# Altium project PDP-11-CPU.PrjPcb
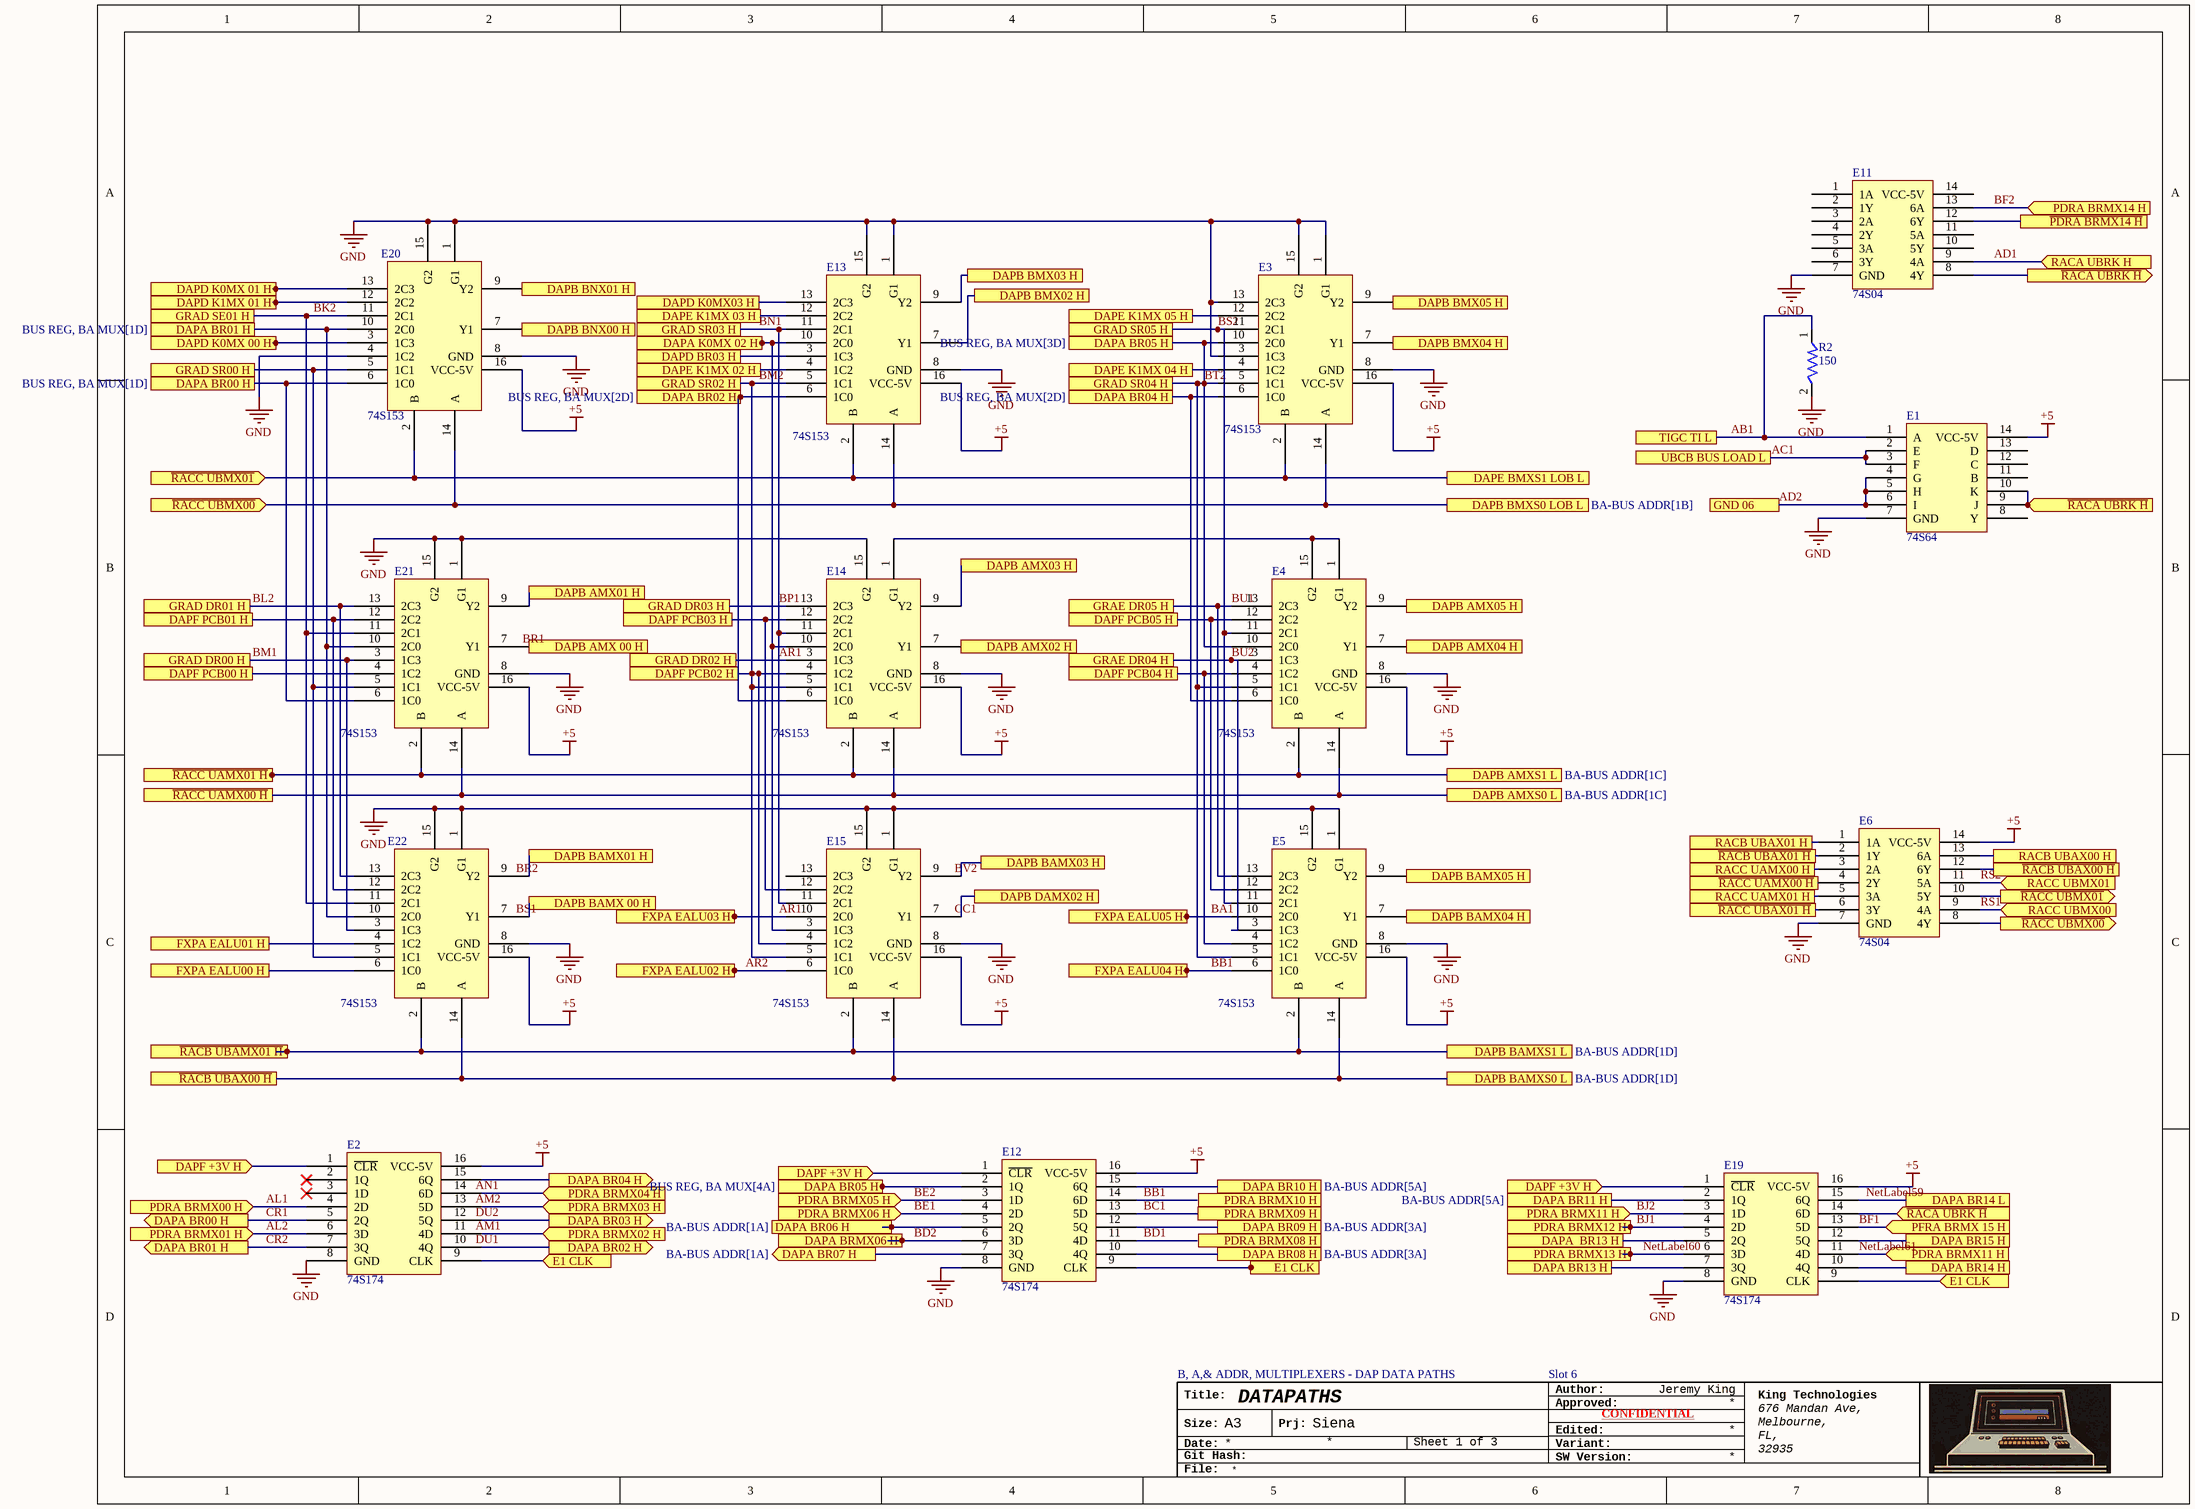
[diagram p0: BUS REG, BA MUX.SchDoc]
3 sheets, 27 parts. Net scope: flat (ports and power ports of the same name join across sheets).
Board file: PDP-11-CPU.PcbDoc
Sheets:
  BUS REG, BA MUX.SchDoc
  BA-BUS ADDR.SchDoc
  BA, BUS MUX.SchDoc

## Sheet BUS REG, BA MUX.SchDoc: DATAPATHS
size A3; Date: .Date; Author: Jeremy King; CompanyName: King Technologies; DrawnBy: Jeremy King; Engineer: Jeremy King; Organization: King Technologies; Address1: 676 Mandan Ave,; Address2: Melbourne,; Address3: FL,; Address4: 32935; DocumentNumber: 1; Revision: 1; SheetNumber: 1; SheetTotal: 3; ProjectTitle: Siena; Time: .Time

### Parts
E1  74S64  [DIP14]
E2  74S174  [DIP16-300]
E3  74S153  [DIP16]
E4  74S153  [DIP16]
E5  74S153  [DIP16]
E6  74S04  [DIP14]
E11  74S04  [DIP14]
E12  74S174  [DIP16-300]
E13  74S153  [DIP16]
E14  74S153  [DIP16]
E15  74S153  [DIP16]
E19  74S174  [DIP16-300]
E20  74S153  [DIP16]
E21  74S153  [DIP16]
E22  74S153  [DIP16]
R2  150  [Axial 0.6]

### Ports
DAPA  BR13 H, DAPA BR00 H (out, see BUS REG, BA MUX[1B]), DAPA BR00 H (see BUS REG, BA MUX[1D]), DAPA BR01 H (out, see BUS REG, BA MUX[1A]), DAPA BR01 H (see BUS REG, BA MUX[1D]), DAPA BR02 H (out, see BUS REG, BA MUX[3B]), DAPA BR02 H (see BUS REG, BA MUX[2D]), DAPA BR03 H (out), DAPA BR04 H (out, see BUS REG, BA MUX[4B]), DAPA BR04 H (see BUS REG, BA MUX[2D]), DAPA BR05 H (see BUS REG, BA MUX[3D]), DAPA BR05 H (see BUS REG, BA MUX[4A]), DAPA BR06 H (out, see BA-BUS ADDR[1A]), DAPA BR07 H (out, see BA-BUS ADDR[1A]), DAPA BR08 H (see BA-BUS ADDR[3A]), DAPA BR09 H (see BA-BUS ADDR[3A]), DAPA BR10 H (see BA-BUS ADDR[5A]), DAPA BR11 H (see BA-BUS ADDR[5A]), DAPA BR13 H, DAPA BR14 H, DAPA BR14 L, DAPA BR15 H, DAPA BRMX06 H (in), DAPA K0MX 02 H, DAPB AMX01 H, DAPB AMX02 H, DAPB AMX03 H, DAPB AMX04 H, DAPB AMX05 H, DAPB AMX 00 H, DAPB AMXS0 L (see BA-BUS ADDR[1C]), DAPB AMXS1 L (see BA-BUS ADDR[1C]), DAPB BAMX01 H, DAPB BAMX03 H, DAPB BAMX04 H, DAPB BAMX05 H, DAPB BAMX 00 H, DAPB BAMXS0 L (see BA-BUS ADDR[1D]), DAPB BAMXS1 L (see BA-BUS ADDR[1D]), DAPB BMX02 H, DAPB BMX03 H, DAPB BMX04 H, DAPB BMX05 H, DAPB BMXS0 LOB L (see BA-BUS ADDR[1B]), DAPB BNX00 H, DAPB BNX01 H, DAPB DAMX02 H, DAPD BR03 H, DAPD K0MX03 H, DAPD K0MX 00 H, DAPD K0MX 01 H, DAPD K1MX 01 H, DAPE BMXS1 LOB L, DAPE K1MX 02 H, DAPE K1MX 03 H, DAPE K1MX 04 H, DAPE K1MX 05 H, DAPF +3V H (in, see BUS REG, BA MUX[1D], BUS REG, BA MUX[3D]), DAPF +3V H (in, see BUS REG, BA MUX[1D], BUS REG, BA MUX[6D]), DAPF +3V H (in, see BUS REG, BA MUX[3D], BUS REG, BA MUX[6D]), DAPF PCB00 H, DAPF PCB01 H, DAPF PCB02 H, DAPF PCB03 H, DAPF PCB04 H, DAPF PCB05 H, E1 CLK (in, see BUS REG, BA MUX[2D], BUS REG, BA MUX[5D]), E1 CLK (in, see BUS REG, BA MUX[2D], BUS REG, BA MUX[8D]), E1 CLK (in, see BUS REG, BA MUX[5D], BUS REG, BA MUX[8D]), FXPA EALU00 H, FXPA EALU01 H, FXPA EALU02 H, FXPA EALU03 H, FXPA EALU04 H, FXPA EALU05 H, GND 06, GRAD DR00 H, GRAD DR01 H, GRAD DR02 H, GRAD DR03 H, GRAD SE01 H, GRAD SR00 H, GRAD SR02 H, GRAD SR03 H, GRAD SR04 H, GRAD SR05 H, GRAE DR04 H, GRAE DR05 H, PDRA BRMX00 H (in), PDRA BRMX01 H (in), PDRA BRMX02 H (in), PDRA BRMX03 H (in), PDRA BRMX04 H (in), PDRA BRMX05 H (in), PDRA BRMX06 H (in), PDRA BRMX08 H (in), PDRA BRMX09 H (in), PDRA BRMX10 H (in), PDRA BRMX11 H (in, see BUS REG, BA MUX[6D]), PDRA BRMX11 H (in, see BUS REG, BA MUX[7D]), PDRA BRMX12 H (in), PDRA BRMX13 H (in), PDRA BRMX14 H (in), PFRA BRMX 15 H (in), RACA UBRK H (in), RACB UBAX00 H, RACB UBAX01 H, RACC UAMX00 H, RACC UAMX01 H, RACC UBMX00 (in), RACC UBMX01 (in), TIGC TI L, UBCB BUS LOAD L, ~{PDRA BRMX14 H}, ~{RACA UBRK H} (in, see BUS REG, BA MUX[7D], BUS REG, BA MUX[8A]), ~{RACA UBRK H} (in, see BUS REG, BA MUX[8A], BUS REG, BA MUX[8B]), ~{RACA UBRK H} (out, see BUS REG, BA MUX[7D], BUS REG, BA MUX[8B]), ~{RACB UBAMX01 H}, ~{RACB UBAX00 H} (see BUS REG, BA MUX[1C]), ~{RACB UBAX00 H} (see BUS REG, BA MUX[8C]), ~{RACB UBAX01 H}, ~{RACC UAMX00 H} (see BUS REG, BA MUX[1C]), ~{RACC UAMX00 H} (see BUS REG, BA MUX[7C]), ~{RACC UAMX01 H}, ~{RACC UBAX01 H}, ~{RACC UBMX00} (in, see BUS REG, BA MUX[8C]), ~{RACC UBMX00} (out, see BUS REG, BA MUX[1B]), ~{RACC UBMX01} (in, see BUS REG, BA MUX[8C]), ~{RACC UBMX01} (out, see BUS REG, BA MUX[1B])

### Nets
+5: E1.14(VCC-5V) E2.16(VCC-5V) E3.16(VCC-5V) E4.16(VCC-5V) E5.16(VCC-5V) E6.14(VCC-5V) E12.16(VCC-5V) E13.16(VCC-5V) E14.16(VCC-5V) E15.16(VCC-5V) E19.16(VCC-5V) E20.16(VCC-5V) E21.16(VCC-5V) E22.16(VCC-5V)
GND: E1.7(GND) E2.8(GND) E3.1(G1) E3.3(1C3) E3.8(GND) E3.13(2C3) E3.15(G2) E4.8(GND) E5.1(G1) E5.8(GND) E5.15(G2) E6.7(GND) E11.7(GND) E12.8(GND) E13.1(G1) E13.8(GND) E13.15(G2) E14.8(GND) E14.15(G2) E15.1(G1) E15.8(GND) E15.15(G2) E19.8(GND) E20.1(G1) E20.4(1C2) E20.8(GND) E20.15(G2) E21.1(G1) E21.8(GND) E21.15(G2) E22.1(G1) E22.8(GND) E22.15(G2) R2.2
AB1: E1.1(A) R2.1 ; port TIGC TI L
AC1: E1.2(E) E1.3(F) ; port UBCB BUS LOAD L
AD1: E11.9(4A) ; port RACA UBRK H
AD2: E1.4(G) E1.5(H) E1.6(I) ; port GND 06
AL1: E2.4(2D) ; port PDRA BRMX00 H
AL2: E2.6(3D) ; port PDRA BRMX01 H
AR1: E13.11(2C1) E14.3(1C3) E14.11(2C1) E14.13(2C3) E15.10(2C0) E15.11(2C1) ; port GRAD SR03 H, port GRAD DR03 H, port GRAD DR02 H, port FXPA EALU03 H  [also labelled BN1, BP1]
AR2: E15.6(1C0) ; port FXPA EALU02 H
BA1: E5.10(2C0) ; port FXPA EALU05 H
BB1: E5.6(1C0) E12.14(6D) ; port FXPA EALU04 H
BC1: E12.13(5D)
BD1: E12.11(4D)
BD2: E12.6(3D) ; port DAPA BRMX06 H
BE1: E12.4(2D) ; port PDRA BRMX06 H
BE2: E12.3(1D) ; port PDRA BRMX05 H
BF1: E19.13(5D) ; port PFRA BRMX 15 H
BF2: E11.13(6A) ; port PDRA BRMX14 H
BJ1: E19.4(2D) ; port PDRA BRMX12 H
BJ2: E19.3(1D) E19.11(4D) ; port PDRA BRMX11 H  [also labelled NetLabel61]
BK2: E20.11(2C1) E21.11(2C1) E22.11(2C1) ; port GRAD SE01 H
BL2: E21.13(2C3) E22.13(2C3) ; port GRAD DR01 H
BM1: E21.3(1C3) E22.3(1C3) ; port GRAD DR00 H
BM2: E13.5(1C1) E14.4(1C2) E14.5(1C1) E15.4(1C2) E15.5(1C1) ; port GRAD SR02 H, port DAPF PCB02 H
BS2: E3.11(2C1) E4.11(2C1) E5.11(2C1) ; port GRAD SR05 H
BT2: E3.5(1C1) E3.10(2C0) E4.5(1C1) E4.10(2C0) E5.5(1C1) E12.2(1Q) ; port DAPA BR05 H, port GRAD SR04 H
BU1: E4.13(2C3) E5.13(2C3) ; port GRAE DR05 H
BU2: E4.3(1C3) E5.3(1C3) ; port GRAE DR04 H
CR1: E2.5(2Q) E20.6(1C0) E21.6(1C0) ; port DAPA BR00 H
CR2: E2.7(3Q) E20.10(2C0) E21.10(2C0) E22.10(2C0) ; port DAPA BR01 H
NetLabel59: E19.15(6Q) ; port DAPA BR14 L
NetLabel60: E19.6(3D) ; port PDRA BRMX13 H
RS1: E6.9(4A) ; port RACC UBMX00
RS2: E6.11(5A) ; port RACC UBMX01
NetE1_9: E1.9(J) E1.10(K) E11.8(4Y) E19.14(6D) ; port ~{RACA UBRK H}
NetE2_1: E2.1(~{CLR}) E12.1(~{CLR}) E19.1(~{CLR}) ; port DAPF +3V H
NetE2_9: E2.9(CLK) E12.9(CLK) E19.9(CLK) ; port E1 CLK
NetE2_10: E2.10(4Q) E13.6(1C0) E14.6(1C0) ; port DAPA BR02 H
NetE2_11: E2.11(4D) ; port PDRA BRMX02 H
NetE2_12: E2.12(5Q) ; port DAPA BR03 H
NetE2_13: E2.13(5D) ; port PDRA BRMX03 H
NetE2_14: E2.14(6D) ; port PDRA BRMX04 H
NetE2_15: E2.15(6Q) E3.6(1C0) E4.6(1C0) ; port DAPA BR04 H
NetE3_2: E3.2(B) E6.10(5Y) E13.2(B) E20.2(B) ; port DAPE BMXS1 LOB L, port ~{RACC UBMX01}
NetE3_4: E3.4(1C2) ; port DAPE K1MX 04 H
NetE3_7: E3.7(Y1) ; port DAPB BMX04 H
NetE3_9: E3.9(Y2) ; port DAPB BMX05 H
NetE3_12: E3.12(2C2) ; port DAPE K1MX 05 H
NetE3_14: E3.14(A) E6.8(4Y) E13.14(A) E20.14(A) ; port DAPB BMXS0 LOB L, port ~{RACC UBMX00}
NetE4_1: E4.1(G1) E4.15(G2) E14.1(G1)
NetE4_2: E4.2(B) E14.2(B) E21.2(B) ; port ~{RACC UAMX01 H}, port DAPB AMXS1 L
NetE4_4: E4.4(1C2) E5.4(1C2) ; port DAPF PCB04 H
NetE4_7: E4.7(Y1) ; port DAPB AMX04 H
NetE4_9: E4.9(Y2) ; port DAPB AMX05 H
NetE4_12: E4.12(2C2) E5.12(2C2) ; port DAPF PCB05 H
NetE4_14: E4.14(A) E6.4(2Y) E14.14(A) E21.14(A) ; port ~{RACC UAMX00 H}, port DAPB AMXS0 L
NetE5_2: E5.2(B) E15.2(B) E22.2(B) ; port ~{RACB UBAMX01 H}, port DAPB BAMXS1 L
NetE5_7: E5.7(Y1) ; port DAPB BAMX04 H
NetE5_9: E5.9(Y2) ; port DAPB BAMX05 H
NetE5_14: E5.14(A) E6.12(6Y) E15.14(A) E22.14(A) ; port ~{RACB UBAX00 H}, port DAPB BAMXS0 L
NetE6_1: E6.1(1A) ; port RACB UBAX01 H
NetE6_2: E6.2(1Y) ; port ~{RACB UBAX01 H}
NetE6_3: E6.3(2A) ; port RACC UAMX00 H
NetE6_5: E6.5(3A) ; port RACC UAMX01 H
NetE6_6: E6.6(3Y) ; port ~{RACC UBAX01 H}
NetE6_13: E6.13(6A) ; port RACB UBAX00 H
NetE11_12: E11.12(6Y) ; port ~{PDRA BRMX14 H}
NetE12_5: E12.5(2Q) ; port DAPA BR06 H
NetE12_7: E12.7(3Q) ; port DAPA BR07 H
NetE12_10: E12.10(4Q) ; port DAPA BR08 H
NetE12_12: E12.12(5Q) ; port DAPA BR09 H
NetE12_15: E12.15(6Q) ; port DAPA BR10 H
NetE13_3: E13.3(1C3) ; port DAPD BR03 H
NetE13_4: E13.4(1C2) ; port DAPE K1MX 02 H
NetE13_7: E13.7(Y1) ; port DAPB BMX02 H
NetE13_9: E13.9(Y2) ; port DAPB BMX03 H
NetE13_10: E13.10(2C0) E14.10(2C0) E15.3(1C3) ; port DAPA K0MX 02 H
NetE13_12: E13.12(2C2) ; port DAPE K1MX 03 H
NetE13_13: E13.13(2C3) ; port DAPD K0MX03 H
NetE14_7: E14.7(Y1) ; port DAPB AMX02 H
NetE14_9: E14.9(Y2) ; port DAPB AMX03 H
NetE14_12: E14.12(2C2) E15.12(2C2) ; port DAPF PCB03 H
NetE15_7: E15.7(Y1) ; port DAPB DAMX02 H
NetE15_9: E15.9(Y2) ; port DAPB BAMX03 H
NetE19_2: E19.2(1Q) ; port DAPA BR11 H
NetE19_5: E19.5(2Q) ; port DAPA  BR13 H
NetE19_7: E19.7(3Q) ; port DAPA BR13 H
NetE19_10: E19.10(4Q) ; port DAPA BR14 H
NetE19_12: E19.12(5Q) ; port DAPA BR15 H
NetE20_3: E20.3(1C3) ; port DAPD K0MX 00 H
NetE20_5: E20.5(1C1) E21.5(1C1) E22.5(1C1) ; port GRAD SR00 H
NetE20_7: E20.7(Y1) ; port DAPB BNX00 H
NetE20_9: E20.9(Y2) ; port DAPB BNX01 H
NetE20_12: E20.12(2C2) ; port DAPD K1MX 01 H
NetE20_13: E20.13(2C3) ; port DAPD K0MX 01 H
NetE21_4: E21.4(1C2) ; port DAPF PCB00 H
NetE21_7: E21.7(Y1) ; port DAPB AMX 00 H
NetE21_9: E21.9(Y2) ; port DAPB AMX01 H
NetE21_12: E21.12(2C2) E22.12(2C2) ; port DAPF PCB01 H
NetE22_4: E22.4(1C2) ; port FXPA EALU01 H
NetE22_6: E22.6(1C0) ; port FXPA EALU00 H
NetE22_7: E22.7(Y1) ; port DAPB BAMX 00 H
NetE22_9: E22.9(Y2) ; port DAPB BAMX01 H

Not connected (* = marked no-connect by the designer): E1 8(Y) 11(B) 12(C) 13(D); E2 2(1Q)* 3(1D)*; E11 1(1A) 2(1Y) 3(2A) 4(2Y) 5(3A) 6(3Y) 10(5Y) 11(5A) 14(VCC-5V); E15 13(2C3)

### Notes on the sheet
- B, A,& ADDR, MULTIPLEXERS - DAP DATA PATHS
- Slot 6
- Labels drawn without touching a wire or pin: AM1, AM2, AN1, BR1, BR2, BS1, BV2, CC1, DU1, DU2
- Title:
- Author:
- Approved:
- Size:
- Date:
- Git Hash:
- A3
- Prj:
- SW Version:
- Variant:
- Edited:
- CONFIDENTIAL
- File:

### Library data of the parts
R2 = Resistor: Supplier 1: Digikey; Supplier Part Number 1: 2019-CF1/4C561J-ND; Supplier 2: Digikey; Supplier Part Number 2: 273-OK1515E-R52CT-ND
E2 E12 E19 = 74S174: Supplier 1: Rochester Electronics; Supplier Part Number 1: SN74S174N
E3-E5 E13-E15 E20-E22 = 74S153: Supplier 1: Rochester Electronics; Supplier Part Number 1: DM74S153N
E6 E11 = 74S04: Supplier 1: Mouser; Supplier Part Number 1: 595-SN74S04N

## Sheet BA-BUS ADDR.SchDoc: DATAPATHS
size A3; Date: .Date; Author: Jeremy King; CompanyName: King Technologies; DrawnBy: Jeremy King; Engineer: Jeremy King; Organization: King Technologies; Address1: 676 Mandan Ave,; Address2: Melbourne,; Address3: FL,; Address4: 32935; DocumentNumber: 1; Revision: 1; SheetNumber: 2; SheetTotal: 3; ProjectTitle: Siena; Time: .Time
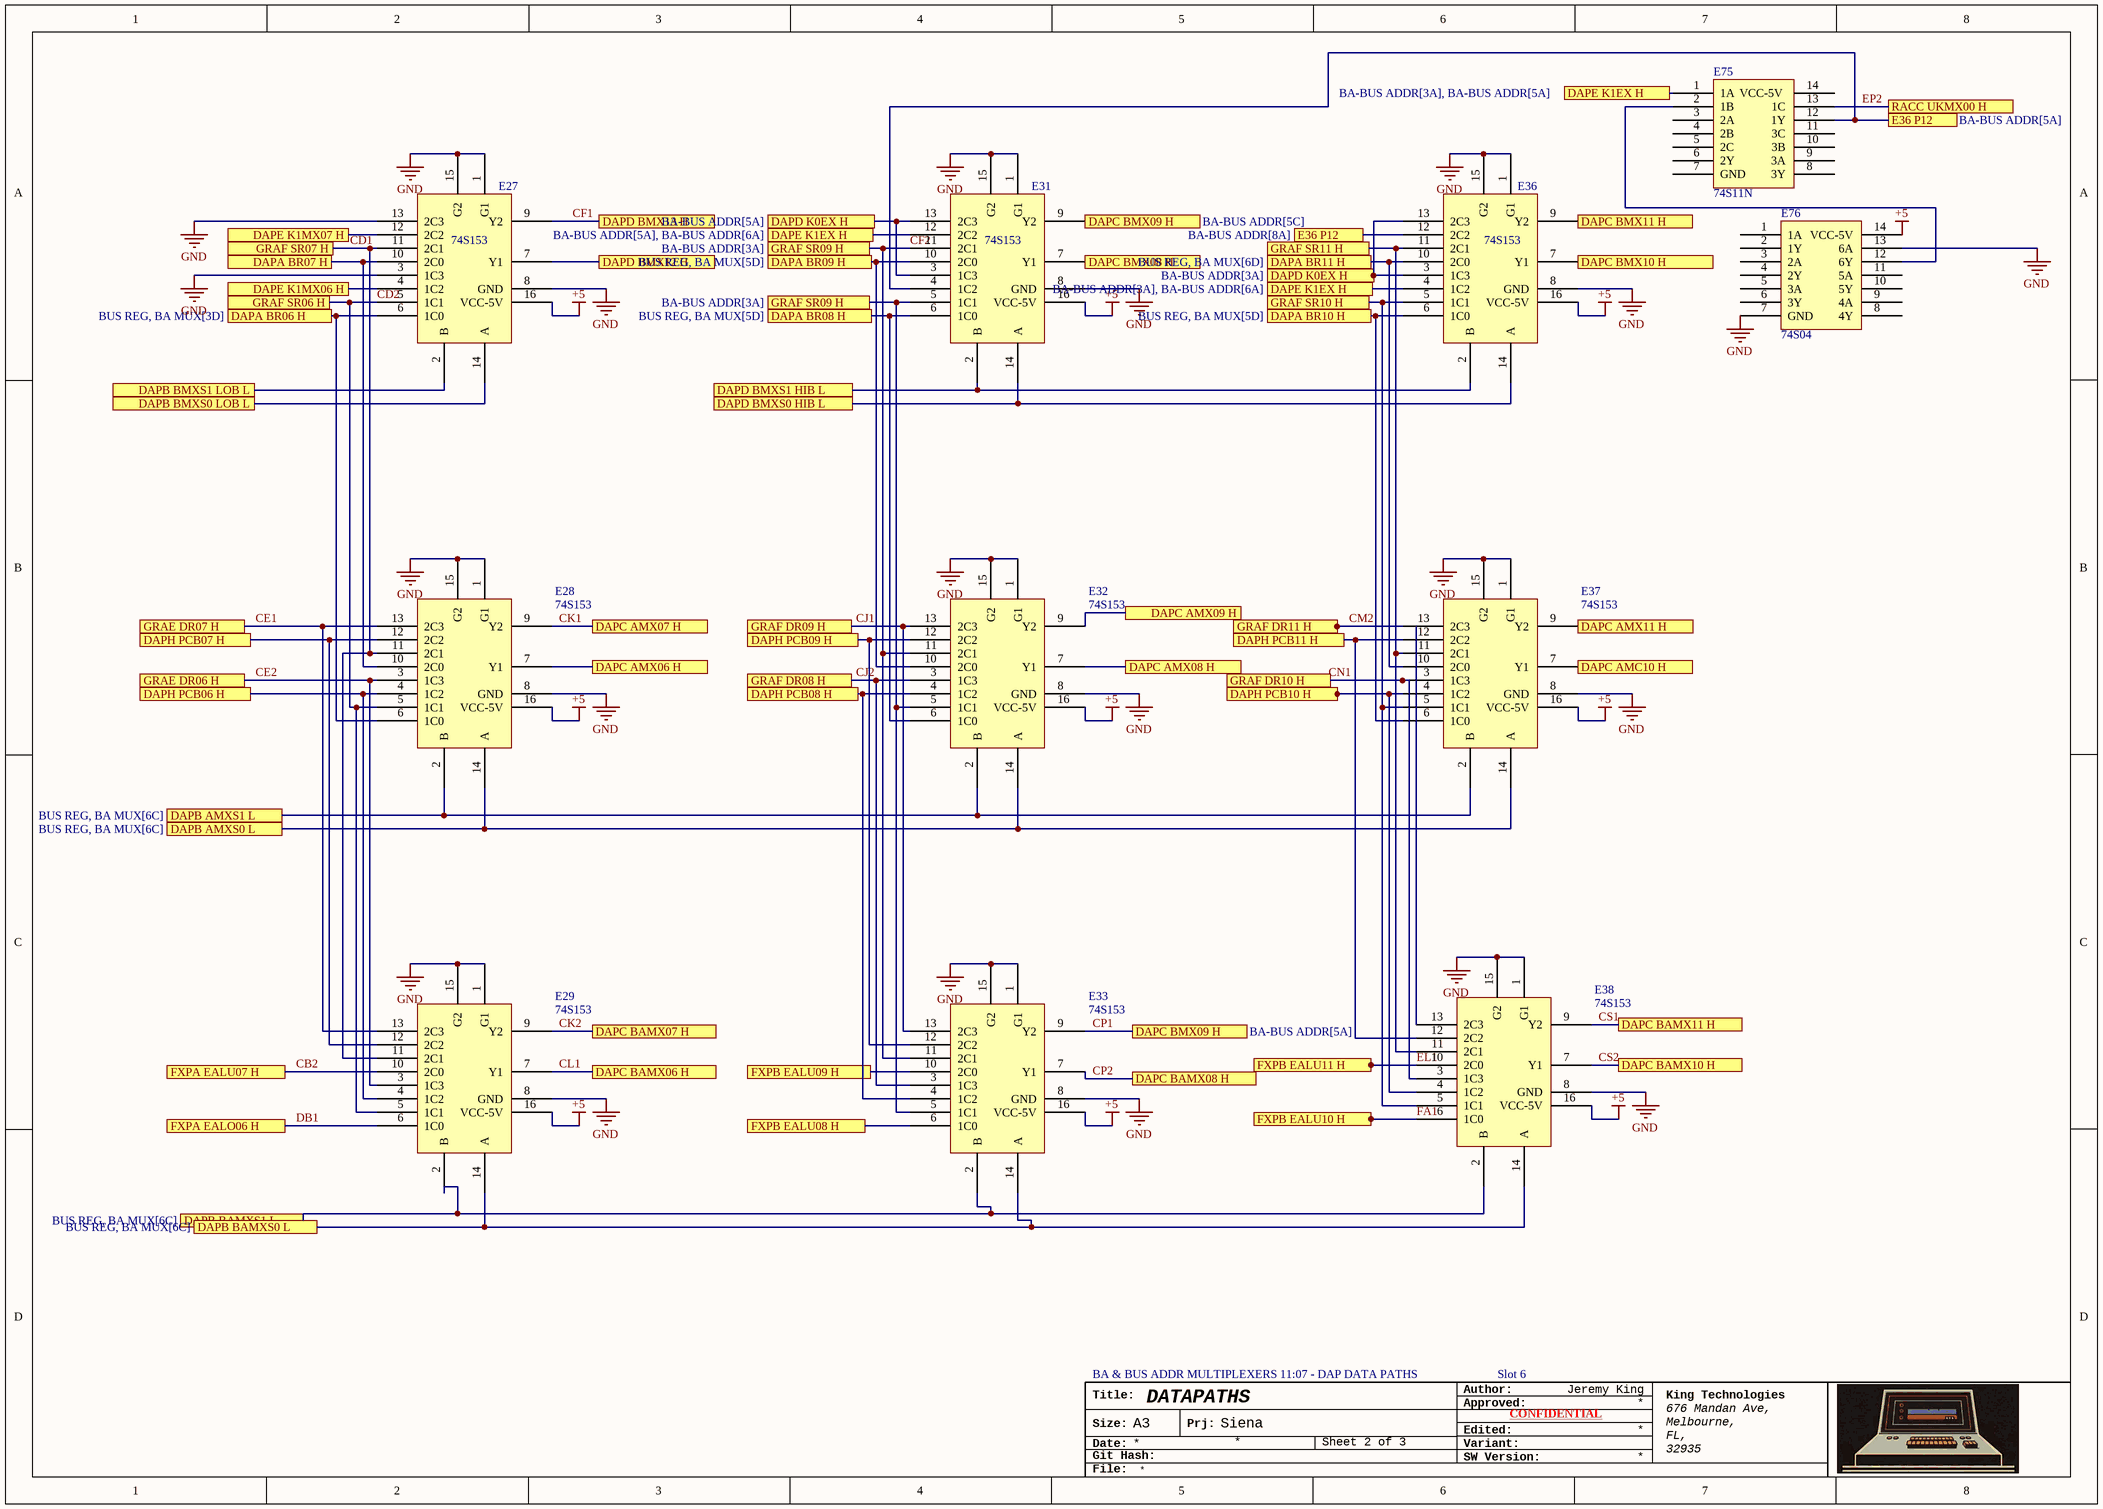
[diagram p1: BA-BUS ADDR.SchDoc]

### Parts
E27  74S153  [DIP16]
E28  74S153  [DIP16]
E29  74S153  [DIP16]
E31  74S153  [DIP16]
E32  74S153  [DIP16]
E33  74S153  [DIP16]
E36  74S153  [DIP16]
E37  74S153  [DIP16]
E38  74S153  [DIP16]
E75  74S11N  [DIP14]
E76  74S04  [DIP14]

### Ports
DAPA BR06 H (see BUS REG, BA MUX[3D]), DAPA BR07 H (see BUS REG, BA MUX[3D]), DAPA BR08 H (see BUS REG, BA MUX[5D]), DAPA BR09 H (see BUS REG, BA MUX[5D]), DAPA BR10 H (see BUS REG, BA MUX[5D]), DAPA BR11 H (see BUS REG, BA MUX[6D]), DAPB AMXS0 L (see BUS REG, BA MUX[6C]), DAPB AMXS1 L (see BUS REG, BA MUX[6C]), DAPB BAMXS0 L (see BUS REG, BA MUX[6C]), DAPB BAMXS1 L (see BUS REG, BA MUX[6C]), DAPB BMXS0 LOB L (see BUS REG, BA MUX[6B]), DAPB BMXS1 LOB L, DAPC AMC10 H, DAPC AMX06 H, DAPC AMX07 H, DAPC AMX08 H, DAPC AMX09 H, DAPC AMX11 H, DAPC BAMX06 H, DAPC BAMX07 H, DAPC BAMX08 H, DAPC BAMX10 H, DAPC BAMX11 H, DAPC BMX08 H, DAPC BMX09 H (see BA-BUS ADDR[5A]), DAPC BMX09 H (see BA-BUS ADDR[5C]), DAPC BMX10 H, DAPC BMX11 H, DAPD BMX12 H, DAPD BMX13 H, DAPD BMXS0 HIB L, DAPD BMXS1 HIB L, DAPD K0EX H (see BA-BUS ADDR[3A]), DAPD K0EX H (see BA-BUS ADDR[5A]), DAPE K1EX H (see BA-BUS ADDR[3A], BA-BUS ADDR[5A]), DAPE K1EX H (see BA-BUS ADDR[3A], BA-BUS ADDR[6A]), DAPE K1EX H (see BA-BUS ADDR[5A], BA-BUS ADDR[6A]), DAPE K1MX06 H, DAPE K1MX07 H, DAPH PCB06 H, DAPH PCB07 H, DAPH PCB08 H, DAPH PCB09 H, DAPH PCB10 H, DAPH PCB11 H, E36 P12 (see BA-BUS ADDR[5A]), E36 P12 (see BA-BUS ADDR[8A]), FXPA EALO06 H, FXPA EALU07 H, FXPB EALU08 H, FXPB EALU09 H, FXPB EALU10 H, FXPB EALU11 H, GRAE DR06 H, GRAE DR07 H, GRAF DR08 H, GRAF DR09 H, GRAF DR10 H, GRAF DR11 H, GRAF SR06 H, GRAF SR07 H, GRAF SR09 H (see BA-BUS ADDR[3A]), GRAF SR10 H, GRAF SR11 H, RACC UKMX00 H

### Nets
+5: E27.16(VCC-5V) E28.16(VCC-5V) E29.16(VCC-5V) E31.16(VCC-5V) E32.16(VCC-5V) E33.16(VCC-5V) E36.16(VCC-5V) E37.16(VCC-5V) E38.16(VCC-5V) E76.14(VCC-5V)
GND: E27.1(G1) E27.3(1C3) E27.8(GND) E27.13(2C3) E27.15(G2) E28.1(G1) E28.8(GND) E28.15(G2) E29.1(G1) E29.8(GND) E29.15(G2) E31.1(G1) E31.8(GND) E31.15(G2) E32.1(G1) E32.8(GND) E32.15(G2) E33.1(G1) E33.8(GND) E33.15(G2) E36.1(G1) E36.8(GND) E36.15(G2) E37.1(G1) E37.8(GND) E37.15(G2) E38.1(G1) E38.8(GND) E38.15(G2) E76.7(GND) E76.13(6A)
CB2: E29.10(2C0) ; port FXPA EALU07 H
CD1: E27.11(2C1) E28.11(2C1) E29.11(2C1) ; port GRAF SR07 H
CD2: E27.5(1C1) E28.5(1C1) E29.5(1C1) ; port GRAF SR06 H
CE1: E28.13(2C3) E29.13(2C3) ; port GRAE DR07 H
CE2: E28.3(1C3) E29.3(1C3) ; port GRAE DR06 H
CF1: E27.9(Y2) ; port DAPD BMX13 H
CF2: E31.5(1C1) E31.11(2C1) E32.5(1C1) E32.11(2C1) E33.5(1C1) E33.11(2C1) ; port GRAF SR09 H
CJ1: E32.13(2C3) E33.13(2C3) ; port GRAF DR09 H
CJ2: E32.3(1C3) E33.3(1C3) ; port GRAF DR08 H
CK1: E28.9(Y2) ; port DAPC AMX07 H
CK2: E29.9(Y2) ; port DAPC BAMX07 H
CL1: E29.7(Y1) ; port DAPC BAMX06 H
CM2: E37.13(2C3) ; port GRAF DR11 H
CP1: E31.9(Y2) E33.9(Y2) ; port DAPC BMX09 H
CP2: E33.7(Y1) ; port DAPC BAMX08 H
CS1: E38.9(Y2) ; port DAPC BAMX11 H
CS2: E38.7(Y1) ; port DAPC BAMX10 H
DB1: E29.6(1C0) ; port FXPA EALO06 H
EL1: E38.10(2C0) ; port FXPB EALU11 H
EP2: E75.13(1C) ; port RACC UKMX00 H
FA1: E38.6(1C0) ; port FXPB EALU10 H
NetE3_14: E27.14(A) ; port DAPB BMXS0 LOB L
NetE4_2: E28.2(B) E32.2(B) E37.2(B) ; port DAPB AMXS1 L
NetE4_14: E28.14(A) E32.14(A) E37.14(A) ; port DAPB AMXS0 L
NetE5_2: E29.2(B) E33.2(B) E38.2(B) ; port DAPB BAMXS1 L
NetE5_14: E29.14(A) E33.14(A) E38.14(A) ; port DAPB BAMXS0 L
NetE12_5: E27.6(1C0) E28.6(1C0) ; port DAPA BR06 H
NetE12_7: E27.10(2C0) E28.10(2C0) ; port DAPA BR07 H
NetE12_10: E31.6(1C0) E32.6(1C0) ; port DAPA BR08 H
NetE12_12: E31.10(2C0) E32.10(2C0) ; port DAPA BR09 H
NetE12_15: E36.6(1C0) E37.6(1C0) ; port DAPA BR10 H
NetE19_2: E36.10(2C0) E37.10(2C0) ; port DAPA BR11 H
NetE27_2: E27.2(B) ; port DAPB BMXS1 LOB L
NetE27_4: E27.4(1C2) ; port DAPE K1MX06 H
NetE27_7: E27.7(Y1) ; port DAPD BMX12 H
NetE27_12: E27.12(2C2) ; port DAPE K1MX07 H
NetE28_4: E28.4(1C2) E29.4(1C2) ; port DAPH PCB06 H
NetE28_7: E28.7(Y1) ; port DAPC AMX06 H
NetE28_12: E28.12(2C2) E29.12(2C2) ; port DAPH PCB07 H
NetE31_2: E31.2(B) E36.2(B) ; port DAPD BMXS1 HIB L
NetE31_3: E31.3(1C3) E31.13(2C3) E36.3(1C3) E36.13(2C3) ; port DAPD K0EX H
NetE31_4: E31.4(1C2) E36.12(2C2) E75.12(1Y) ; port E36 P12
NetE31_7: E31.7(Y1) ; port DAPC BMX08 H
NetE31_12: E31.12(2C2) E36.4(1C2) E75.1(1A) ; port DAPE K1EX H
NetE31_14: E31.14(A) E36.14(A) ; port DAPD BMXS0 HIB L
NetE32_4: E32.4(1C2) E33.4(1C2) ; port DAPH PCB08 H
NetE32_7: E32.7(Y1) ; port DAPC AMX08 H
NetE32_9: E32.9(Y2) ; port DAPC AMX09 H
NetE32_12: E32.12(2C2) E33.12(2C2) ; port DAPH PCB09 H
NetE33_6: E33.6(1C0) ; port FXPB EALU08 H
NetE33_10: E33.10(2C0) ; port FXPB EALU09 H
NetE36_5: E36.5(1C1) E37.5(1C1) E38.5(1C1) ; port GRAF SR10 H
NetE36_7: E36.7(Y1) ; port DAPC BMX10 H
NetE36_9: E36.9(Y2) ; port DAPC BMX11 H
NetE36_11: E36.11(2C1) E37.11(2C1) E38.11(2C1) ; port GRAF SR11 H
NetE37_3: E37.3(1C3) E38.3(1C3) ; port GRAF DR10 H
NetE37_4: E37.4(1C2) E38.4(1C2) ; port DAPH PCB10 H
NetE37_7: E37.7(Y1) ; port DAPC AMC10 H
NetE37_9: E37.9(Y2) ; port DAPC AMX11 H
NetE37_12: E37.12(2C2) E38.12(2C2) ; port DAPH PCB11 H
NetE75_2: E75.2(1B) E76.12(6Y)

Not connected (* = marked no-connect by the designer): E38 13(2C3); E75 3(2A) 4(2B) 5(2C) 6(2Y) 7(GND) 8(3Y) 9(3A) 10(3B) 11(3C) 14(VCC-5V_); E76 1(1A) 2(1Y) 3(2A) 4(2Y) 5(3A) 6(3Y) 8(4Y) 9(4A) 10(5Y) 11(5A)

### Notes on the sheet
- BA & BUS ADDR MULTIPLEXERS 11:07 - DAP DATA PATHS
- Slot 6
- Labels drawn without touching a wire or pin: CN1
- Title:
- Author:
- Approved:
- Size:
- Date:
- Git Hash:
- A3
- Prj:
- SW Version:
- Variant:
- Edited:
- CONFIDENTIAL
- File:

### Library data of the parts
E27-E29 E31-E33 E36-E38 = 74S153: Supplier 1: Rochester Electronics; Supplier Part Number 1: DM74S153N
E75 = 74S11N: Supplier 1: Rochester Electronics; Supplier Part Number 1: SN74S11N
E76 = 74S04: Supplier 1: Mouser; Supplier Part Number 1: 595-SN74S04N

## Sheet BA, BUS MUX.SchDoc: DATAPATHS
size A3; Date: .Date; Author: Jeremy King; CompanyName: King Technologies; DrawnBy: Jeremy King; Engineer: Jeremy King; Organization: King Technologies; Address1: 676 Mandan Ave,; Address2: Melbourne,; Address3: FL,; Address4: 32935; DocumentNumber: 1; Revision: 1; SheetNumber: 3; SheetTotal: 3; ProjectTitle: Siena; Time: .Time
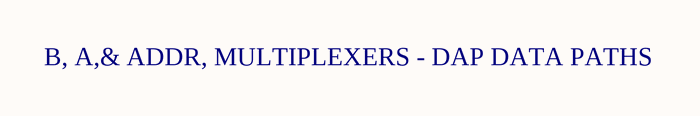
[diagram p2: BA, BUS MUX.SchDoc]

### Notes on the sheet
- B, A,& ADDR, MULTIPLEXERS - DAP DATA PATHS
- Title:
- Author:
- Approved:
- Size:
- Date:
- Git Hash:
- A3
- Prj:
- SW Version:
- Variant:
- Edited:
- CONFIDENTIAL
- File:

## Nets that join several sheets
+5: BUS REG, BA MUX (14 pins), BA-BUS ADDR (10 pins)
GND: BUS REG, BA MUX (34 pins), BA-BUS ADDR (31 pins)
NetE3_14: BUS REG, BA MUX (E3.14 E6.8 E13.14 E20.14), BA-BUS ADDR (E27.14)
NetE4_2: BUS REG, BA MUX (E4.2 E14.2 E21.2), BA-BUS ADDR (E28.2 E32.2 E37.2)
NetE4_14: BUS REG, BA MUX (E4.14 E6.4 E14.14 E21.14), BA-BUS ADDR (E28.14 E32.14 E37.14)
NetE5_2: BUS REG, BA MUX (E5.2 E15.2 E22.2), BA-BUS ADDR (E29.2 E33.2 E38.2)
NetE5_14: BUS REG, BA MUX (E5.14 E6.12 E15.14 E22.14), BA-BUS ADDR (E29.14 E33.14 E38.14)
NetE12_5: BUS REG, BA MUX (E12.5), BA-BUS ADDR (E27.6 E28.6)
NetE12_7: BUS REG, BA MUX (E12.7), BA-BUS ADDR (E27.10 E28.10)
NetE12_10: BUS REG, BA MUX (E12.10), BA-BUS ADDR (E31.6 E32.6)
NetE12_12: BUS REG, BA MUX (E12.12), BA-BUS ADDR (E31.10 E32.10)
NetE12_15: BUS REG, BA MUX (E12.15), BA-BUS ADDR (E36.6 E37.6)
NetE19_2: BUS REG, BA MUX (E19.2), BA-BUS ADDR (E36.10 E37.10)